# EAGLE schematic powerSupply (EAGLE 9.5.2)
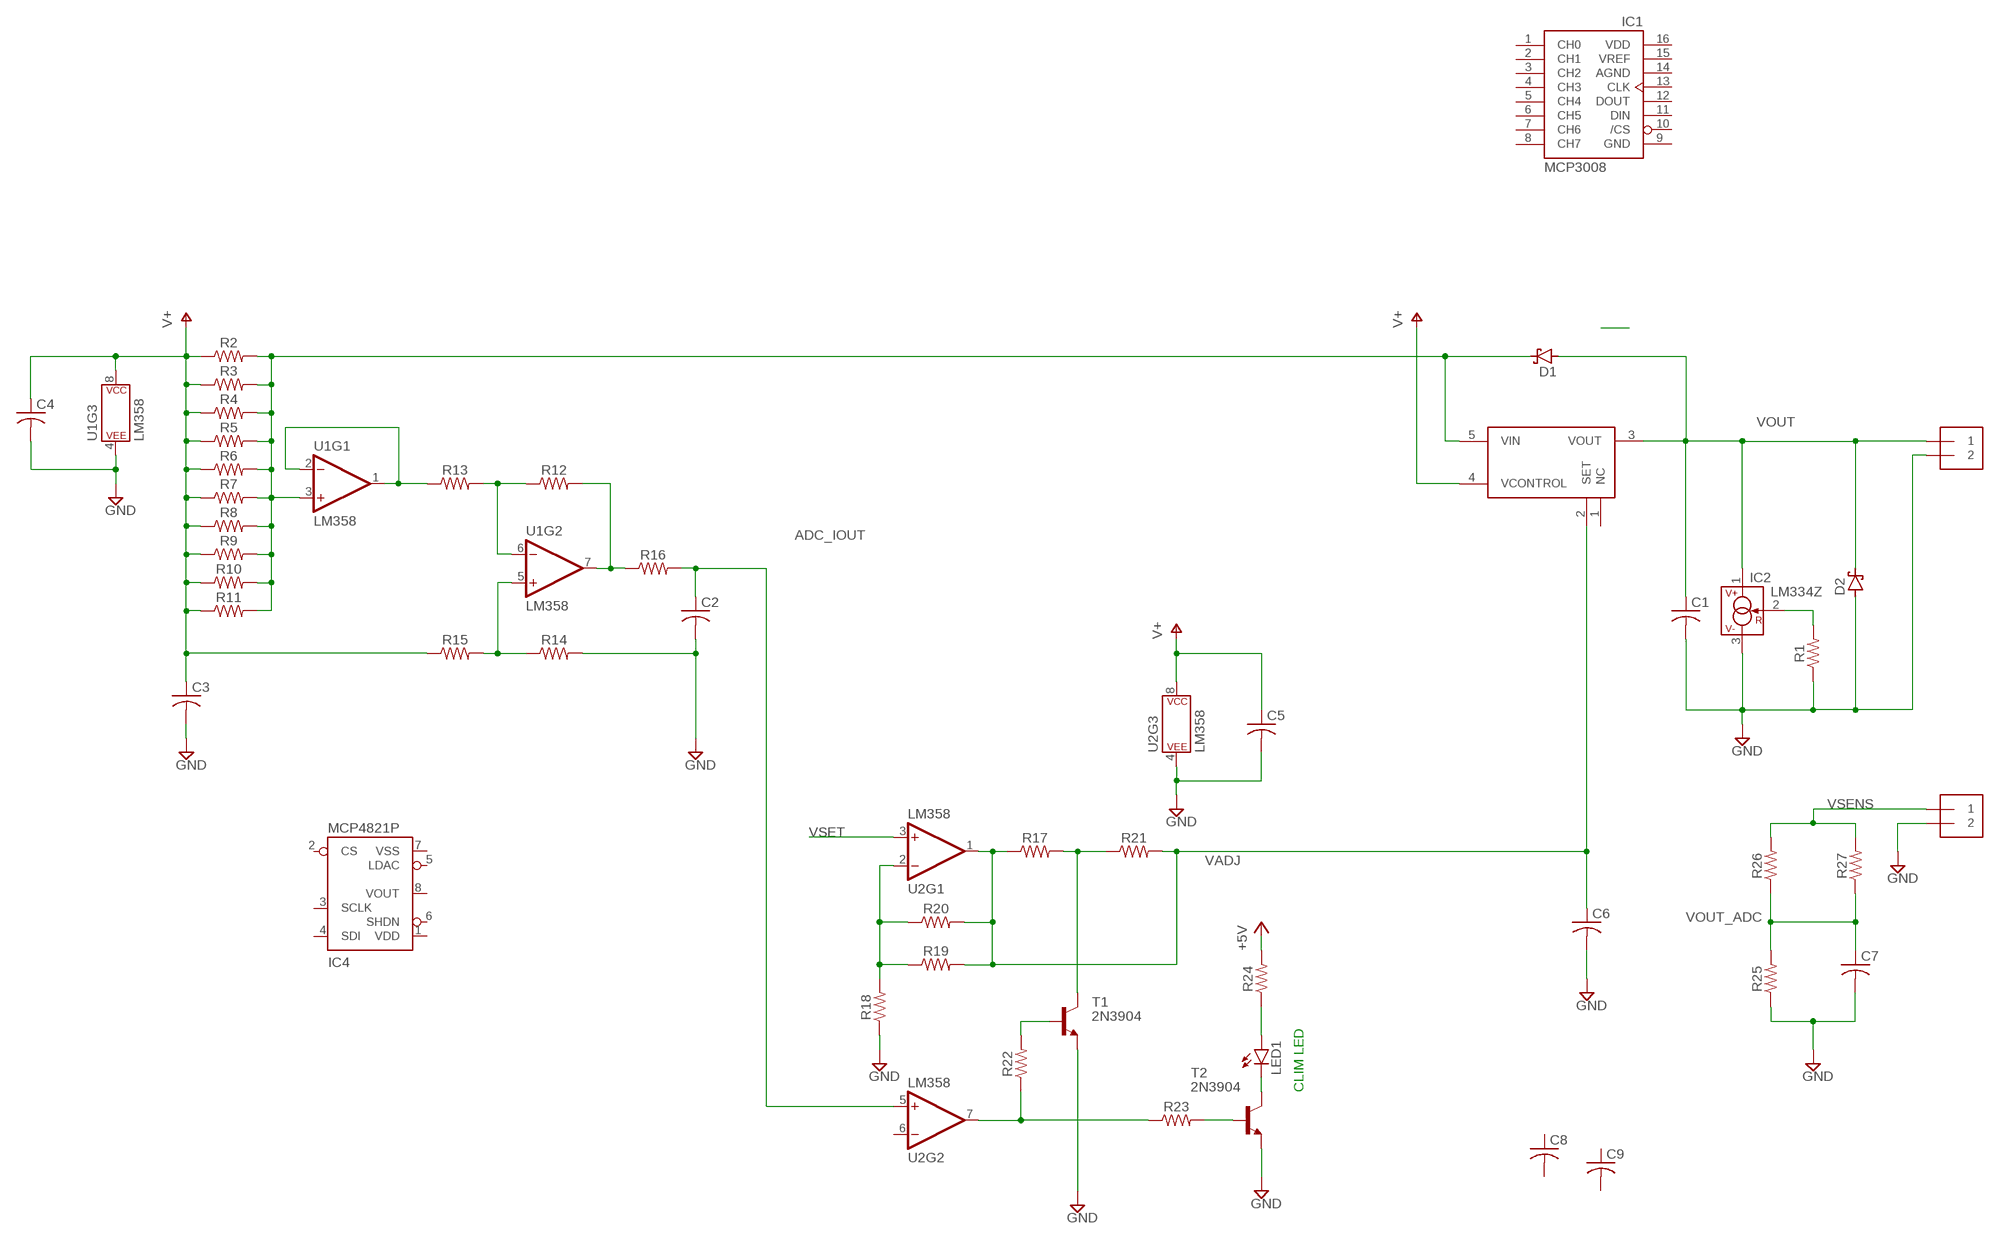
[diagram p0: schematic, sheet 1]

## Parts
C1  C-US050-024X044  [C050-024X044]
C2  C-US050-024X044  [C050-024X044]
C3  C-US050-024X044  [C050-024X044]
C4  C-US050-024X044  [C050-024X044]
C5  C-US050-024X044  [C050-024X044]
C6  C-US050-024X044  [C050-024X044]
C7  C-US050-024X044  [C050-024X044]
C8  C-US050-024X044  [C050-024X044]
C9  C-US050-024X044  [C050-024X044]
D1  SCHOTTKY-DIODEC4111-15  [C4111-15]
D2  SCHOTTKY-DIODEC4111-15  [C4111-15]
IC1  MCP3008  [DIL16]
IC2  LM334Z  [TO92]
IC4  MCP4821P  [DIP08]
J1  1X2-3.5MM  [1X2-3.5MM]
J2  1X2-3.5MM  [1X2-3.5MM]
LED1  LED5MM  [LED5MM]
R1  RESISTORAXIAL-0.3  [AXIAL-0.3]
R2  RESISTORAXIAL-0.3  [AXIAL-0.3]
R3  RESISTORAXIAL-0.3  [AXIAL-0.3]
R4  RESISTORAXIAL-0.3  [AXIAL-0.3]
R5  RESISTORAXIAL-0.3  [AXIAL-0.3]
R6  RESISTORAXIAL-0.3  [AXIAL-0.3]
R7  RESISTORAXIAL-0.3  [AXIAL-0.3]
R8  RESISTORAXIAL-0.3  [AXIAL-0.3]
R9  RESISTORAXIAL-0.3  [AXIAL-0.3]
R10  RESISTORAXIAL-0.3  [AXIAL-0.3]
R11  RESISTORAXIAL-0.3  [AXIAL-0.3]
R12  RESISTORAXIAL-0.3  [AXIAL-0.3]
R13  RESISTORAXIAL-0.3  [AXIAL-0.3]
R14  RESISTORAXIAL-0.3  [AXIAL-0.3]
R15  RESISTORAXIAL-0.3  [AXIAL-0.3]
R16  RESISTORAXIAL-0.3  [AXIAL-0.3]
R17  RESISTORAXIAL-0.3  [AXIAL-0.3]
R18  RESISTORAXIAL-0.3  [AXIAL-0.3]
R19  RESISTORAXIAL-0.3  [AXIAL-0.3]
R20  RESISTORAXIAL-0.3  [AXIAL-0.3]
R21  RESISTORAXIAL-0.3  [AXIAL-0.3]
R22  RESISTORAXIAL-0.3  [AXIAL-0.3]
R23  RESISTORAXIAL-0.3  [AXIAL-0.3]
R24  RESISTORAXIAL-0.3  [AXIAL-0.3]
R25  RESISTORAXIAL-0.3  [AXIAL-0.3]
R26  RESISTORAXIAL-0.3  [AXIAL-0.3]
R27  RESISTORAXIAL-0.3  [AXIAL-0.3]
T1  2N3904  [TO92]
T2  2N3904  [TO92]
U1  LM358  [DIP08]
U2  LM358  [DIP08]
U$1  LT3080T  [TO220-5]

## Nets
+5V: R24.P$2
ADC_IOUT: C2.1 R16.P$2 U2.5(+IN)
GND: C1.2 C2.2 C3.2 C4.2 C5.2 C6.2 C7.2 D2.A IC2.3(V-) J1.2 J2.2 R1.P$1 R14.P$2 R18.P$1 R25.P$1 T1.3(E) T2.3(E) U1.4(P$V-) U2.4(P$V-)
N$2: IC2.2(R) R1.P$2
N$4: D1.C R2.P$2 R3.P$2 R4.P$2 R5.P$2 R6.P$2 R7.P$2 R8.P$2 R9.P$2 R10.P$2 R11.P$2 U1.3(+IN) U$1.5(VIN)
N$6: R13.P$1 U1.1(OUT) U1.2(-IN)
N$7: R12.P$1 R13.P$2 U1.6(-IN)
N$8: R17.P$2 R21.P$1 T1.1(C)
N$9: R14.P$1 R15.P$2 U1.5(+IN)
N$10: C5.1 U2.8(P$V+) ; supply symbol labelled V+
N$11: R12.P$2 R16.P$1 U1.7(OUT)
N$12: R22.P$2 T1.2(B)
N$13: R18.P$2 R19.P$1 R20.P$1 U2.2(-IN)
N$14: R22.P$1 R23.P$1 U2.7(OUT)
N$15: R23.P$2 T2.2(B)
N$16: LED1.K(C) T2.1(C)
N$17: LED1.A R24.P$1
V+: C3.1 C4.1 R2.P$1 R3.P$1 R4.P$1 R5.P$1 R6.P$1 R7.P$1 R8.P$1 R9.P$1 R10.P$1 R11.P$1 R15.P$1 U1.8(P$V+) U$1.4(VCONTROL)
VADJ: C6.1 R17.P$1 R19.P$2 R20.P$2 R21.P$2 U2.1(OUT) U$1.2(SET)
VOUT: C1.1 D1.A D2.C IC2.1(V+) J1.1 U$1.3(VOUT)
VOUT_ADC: C7.1 R25.P$2 R26.P$1 R27.P$1
VSENS: J2.1 R26.P$2 R27.P$2
VSET: U2.3(+IN)
Unconnected: C8.1 C8.2 C9.1 C9.2 IC1.1(CH0) IC1.2(CH1) IC1.3(CH2) IC1.4(CH3) IC1.5(CH4) IC1.6(CH5) IC1.7(CH6) IC1.8(CH7) IC1.10(/CS) IC1.11(DIN) IC1.12(DOUT) IC1.13(CLK) IC1.15(VREF) IC4.2(CS) IC4.3(SCLK) IC4.4(SDI) IC4.5(LDAC) IC4.6(SHDN) IC4.8(VOUT) U2.6(-IN) U$1.1(NC)

## Notes on the sheet
- CLIM LED

## Power pins joined to a net without a drawn wire
AGND: IC1.14(AGND)
GND: IC1.9(GND)
VDD: IC1.16(VDD) IC4.1(VDD)
VSS: IC4.7(VSS)

## Library data of the parts
C1-C9 = adafruit:C-US: CAPACITOR, American symbol
D1 D2 = diode:SCHOTTKY-DIODE: Schottky Diode
IC1 = adafruit:MCP3008
IC2 = linear:LM*34: 3-Terminal Adjustable Current Sources Source: www.national.com/pf/LM/LM334.html | LM134.pdf
IC4 = mixedSignal:MCP4821P: 12-Bit Voltage Output Digital-to-Analog Converter with Internal VREF and SPI Interface
J1 J2 = adafruit:1X2: 3.5mm Terminal block http://www.ladyada.net/library/pcb/eaglelibrary.html
LED1 = led:LED: LED OSRAM: - CHIPLED LG R971, LG N971, LY N971, LG Q971, LY Q971, LO R971, LY R971 LH N974, LH R974 LS Q976, LO Q976, LY Q976 LO Q996 - Hyper CHIPLED LW Q18S LB Q993, LB Q99A, LB R99A - SideLED LS A670, LO A670, LY A670, LG A670, LP A670 LB A673, LV A673, LT A673, LW A673 LH A674 LY A675 LS A676, LA A676, LO A676, LY A676, LW A676 LS A679, LY A679, LG A679 - Hyper Micro SIDELED® LS Y876, LA Y876, LO Y876, LY Y876 LT Y87S - SmartLED LW L88C, LW L88S LB L89C, LB L89S, LG L890 LS L89K, LO L89K, LY L89K LS L896, LA L896, LO L896, LY L896 - TOPLED LS T670, LO T670, LY T670, LG T670, LP T670 LSG T670, LSP T670, LSY T670, LOP T670, LYG T670 LG T671, LOG T671, LSG T671 LB T673, LV T673, LT T673, LW T673 LH T674 LS T676, LA T676, LO T676, LY T676, LB T676, LH T676, LSB T676, LW T676 LB T67C, LV T67C, LT T67C, LS T67K, LO T67K, LY T67K, LW E67C LS E67B, LA E67B, LO E67B, LY E67B, LB E67C, LV E67C, LT E67C LW T67C LS T679, LY T679, LG T679 LS T770, LO T770, LY T770, LG T770, LP T770 LB T773, LV T773, LT T773, LW T773 LH T774 LS E675, LA E675, LY E675, LS T675 LS T776, LA T776, LO T776, LY T776, LB T776 LHGB T686 LT T68C, LB T68C - Hyper Mini TOPLED® LB M676 - Mini TOPLED Santana® LG M470 LS M47K, LO M47K, LY M47K Source: http://www.osram.convergy.de LUXEON: - LUMILED® LXK2-PW12-R00, LXK2-PW12-S00, LXK2-PW14-U00, LXK2-PW14-V00 LXK2-PM12-R00, LXK2-PM12-S00, LXK2-PM14-U00 LXK2-PE12-Q00, LXK2-PE12-R00, LXK2-PE12-S00, LXK2-PE14-T00, LXK2-PE14-U00 LXK2-PB12-K00, LXK2-PB12-L00, LXK2-PB12-M00, LXK2-PB14-N00, LXK2-PB14-P00, LXK2-PB14-Q00 LXK2-PR12-L00, LXK2-PR12-M00, LXK2-PR14-Q00, LXK2-PR14-R00 LXK2-PD12-Q00, LXK2-PD12-R00, LXK2-PD12-S00 LXK2-PH12-R00, LXK2-PH12-S00 LXK2-PL12-P00, LXK2-PL12-Q00, LXK2-PL12-R00 Source: www.luxeon.com KINGBRIGHT: KA-3528ASYC Source: www.kingbright.com
R1-R27 = SparkFun-Resistors:RESISTOR: Generic Resistor Package
T1 T2 = transistor:2N3904: NPN TRANSISTOR
U1 U2 = SparkFun-IC-Amplifiers:LM358: LM358 Jellybean op-amp Datasheet <http://www.sparkfun.com/datasheets/Components/General/LM358.pdf> SparkFun Products Op-Amp (Thru-Hole) - LM358 <https://www.sparkfun.com/products/9456> (COM-09456); PROD_ID: IC-09172
U$1 = LinearRegulators:LT3080T: Adjustable 3A Single Resistor Low Dropout Regulator